# Altium project greenhouse_MA_2.PrjPcb
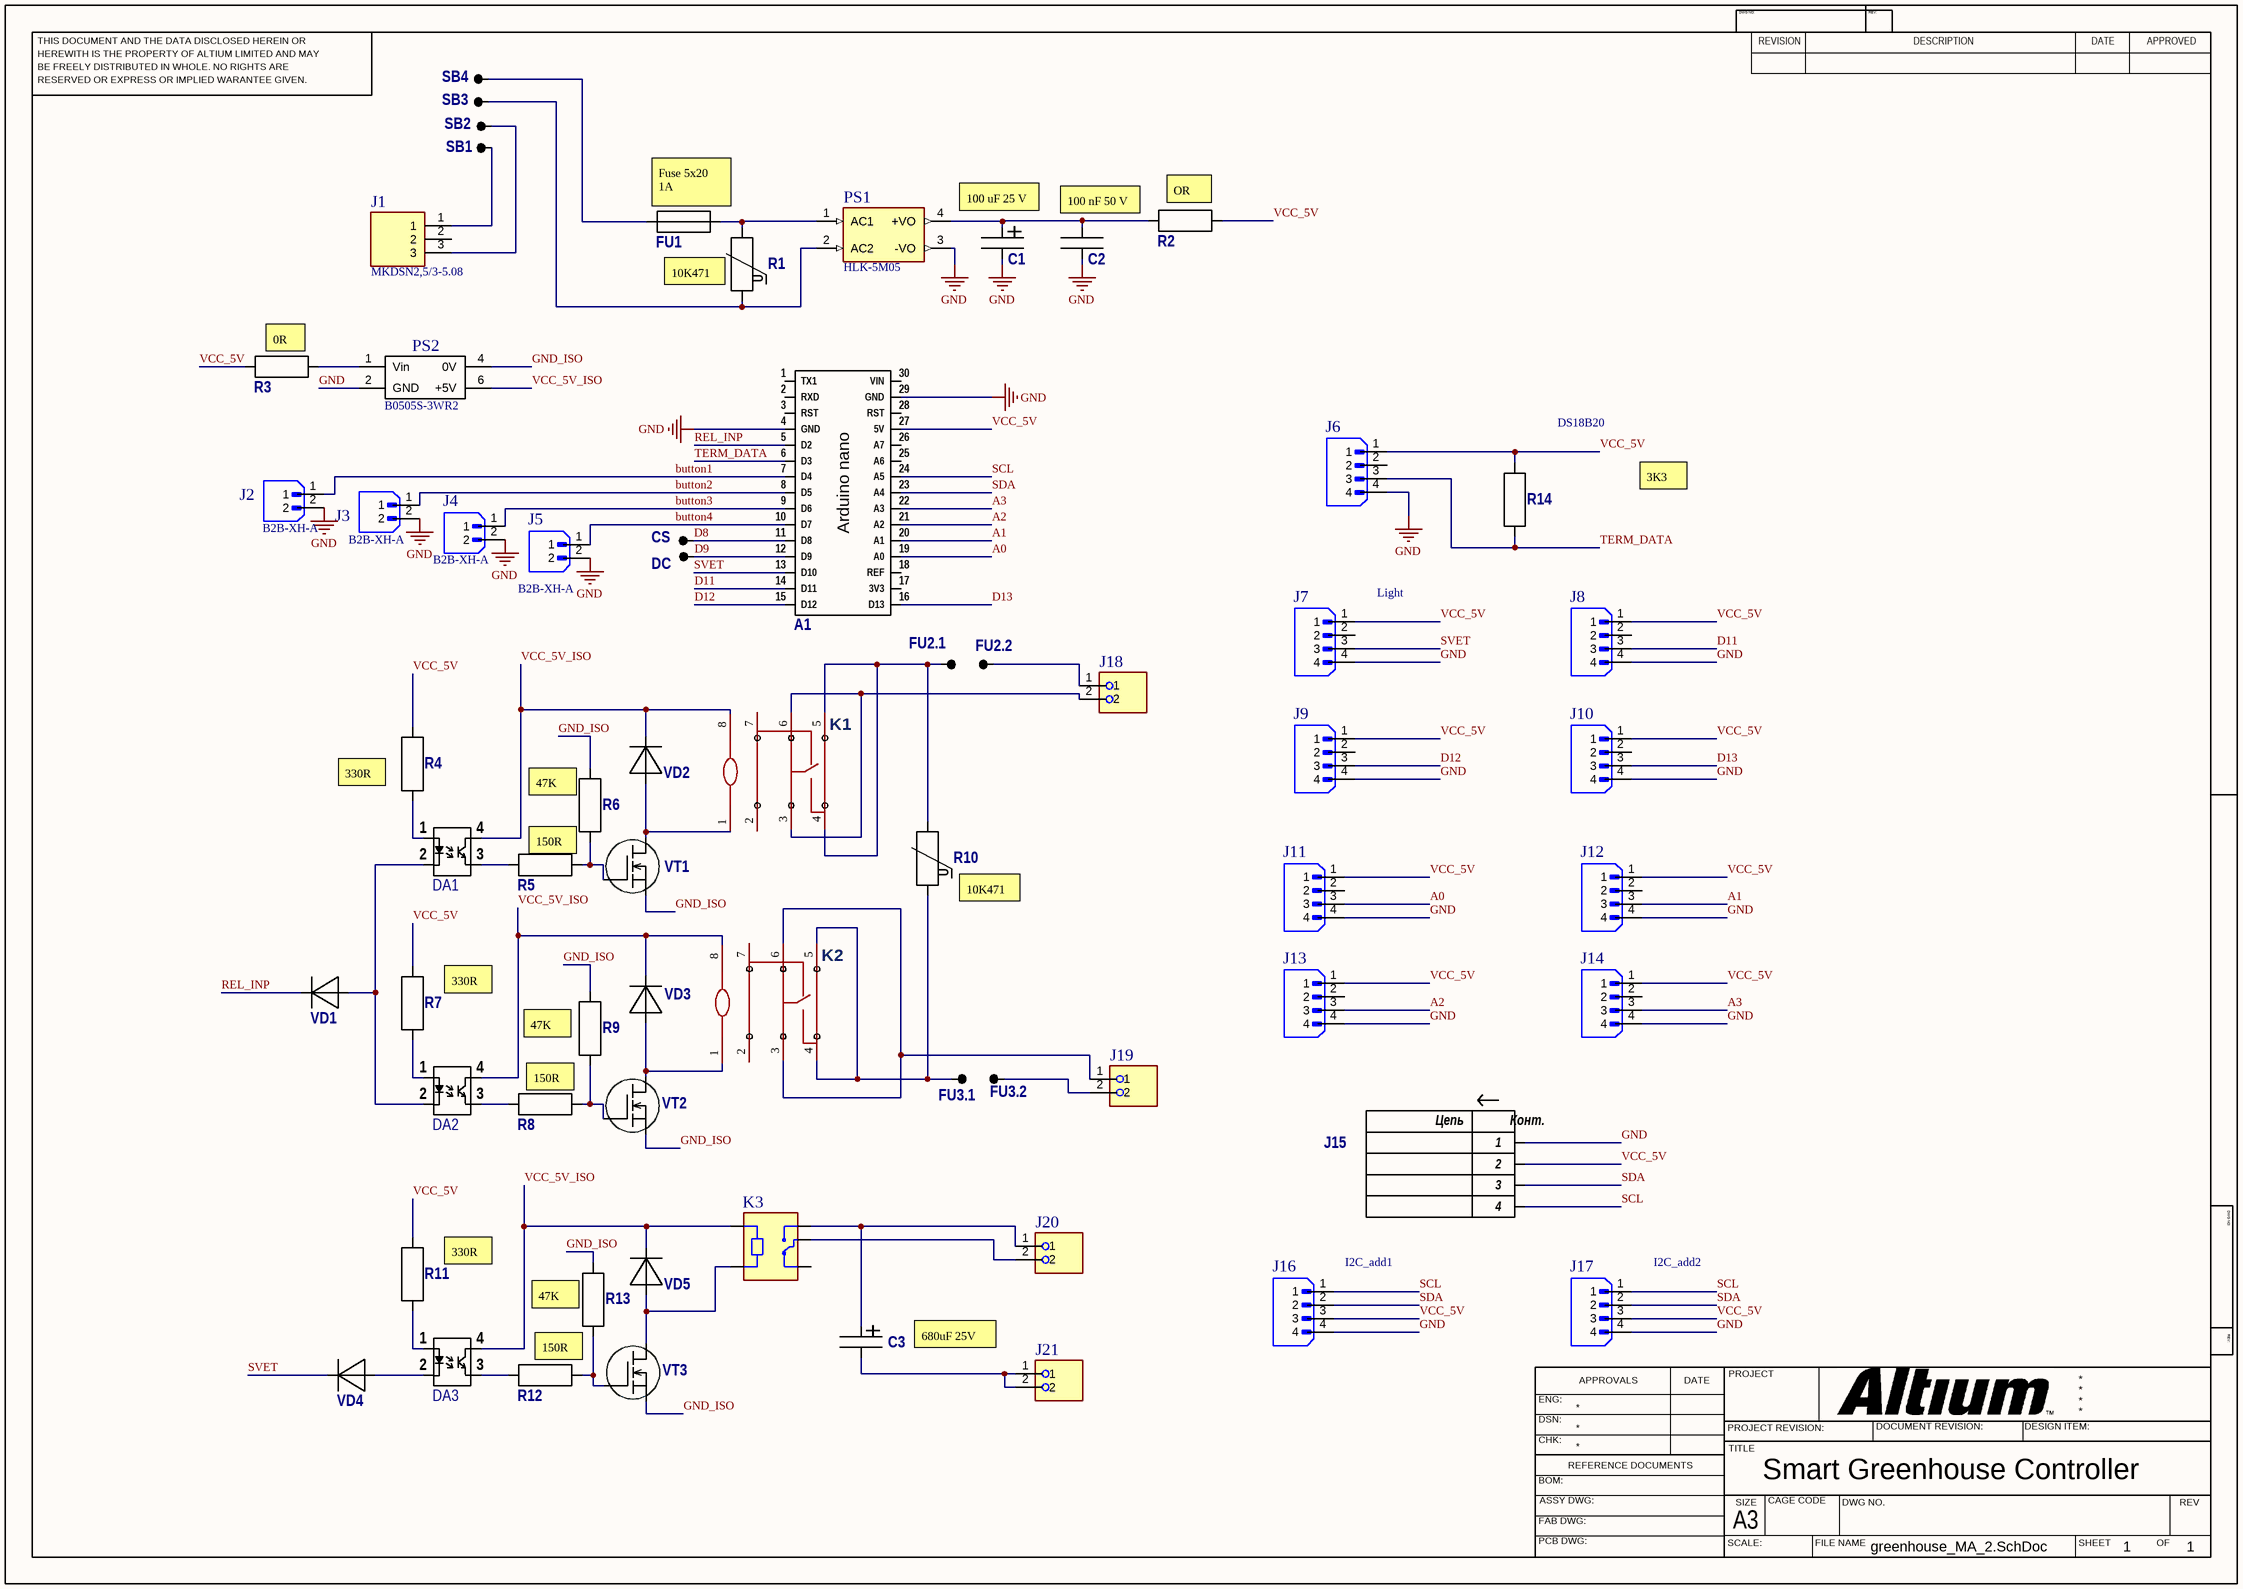
[diagram p0: greenhouse_MA_2.SchDoc]
1 sheet, 66 parts. Net scope: global (net labels, ports and power ports of the same name join across sheets).
Board file: greenhouse_MA_2PCB.PcbDoc

## Sheet greenhouse_MA_2.SchDoc: Smart Greenhouse Controller
size 420 x 297 mm; Author: Andrei Moskvin; Revision: v2; SheetNumber: 1; SheetTotal: 1

### Parts
A1  Arduino Nano  [Arduino nano]  (value not drawn)
C1  100uF 25V Electrolytic Capacitor THT Radial  [capr- 2.5D6.5H12]  (value not drawn)
C2  100nF 50V X7R THT 5mm  [C__s 5-d 5.5-t4]  (value not drawn)
C3  680uF 25V Electrolytic Capacitor THT Radial  [capr- 3.5D8H20]  (value not drawn)
CS  Отпайка  [Отпайка 0,5]  (value not drawn)
DA1  Optocoupler EL817 DIP-4  [DIP-4]  (value not drawn)
DA2  Optocoupler EL817 DIP-4  [DIP-4]  (value not drawn)
DA3  Optocoupler EL817 DIP-4  [DIP-4]  (value not drawn)
DC  Отпайка  [Отпайка 0,5]  (value not drawn)
FU1  1A slow 5x20 mm  [FU_FC-001-N(DH)]  (value not drawn)
FU2.1  Отпайка  [Отпайка 1.5]  (value not drawn)
FU2.2  Отпайка  [Отпайка 1.5]  (value not drawn)
FU3.1  Отпайка  [Отпайка 1.5]  (value not drawn)
FU3.2  Отпайка  [Отпайка 1.5]  (value not drawn)
J1  MKDSN2,5/3-5.08  [PHOENIX_MKDSN2,5/3-5.08]
J2  B2B-XH-A  [JST_B2B-XH-A]
J3  B2B-XH-A  [JST_B2B-XH-A]
J4  B2B-XH-A  [JST_B2B-XH-A]
J5  B2B-XH-A  [JST_B2B-XH-A]
J6  JST B4B-XH-A Connector 1x4 2.5mm THT Vertical  [JST_B4B-XH-A]  (value not drawn)
J7  JST B4B-XH-A Connector 1x4 2.5mm THT Vertical  [JST_B4B-XH-A]  (value not drawn)
J8  JST B4B-XH-A Connector 1x4 2.5mm THT Vertical  [JST_B4B-XH-A]  (value not drawn)
J9  JST B4B-XH-A Connector 1x4 2.5mm THT Vertical  [JST_B4B-XH-A]  (value not drawn)
J10  JST B4B-XH-A Connector 1x4 2.5mm THT Vertical  [JST_B4B-XH-A]  (value not drawn)
J11  JST B4B-XH-A Connector 1x4 2.5mm THT Vertical  [JST_B4B-XH-A]  (value not drawn)
J12  JST B4B-XH-A Connector 1x4 2.5mm THT Vertical  [JST_B4B-XH-A]  (value not drawn)
J13  JST B4B-XH-A Connector 1x4 2.5mm THT Vertical  [JST_B4B-XH-A]  (value not drawn)
J14  JST B4B-XH-A Connector 1x4 2.5mm THT Vertical  [JST_B4B-XH-A]  (value not drawn)
J15  Pin Header 1x4 2.54mm Right Angle THT Male  [KLS1-207-1*04 R]  (value not drawn)
J16  JST B4B-XH-A Connector 1x4 2.5mm THT Vertical  [JST_B4B-XH-A]  (value not drawn)
J17  JST B4B-XH-A Connector 1x4 2.5mm THT Vertical  [JST_B4B-XH-A]  (value not drawn)
J18  Phoenix Contact MKDSN 2,5/2-5.08 Terminal Block 1x2 5.08mm THT  [PHOENIX_1729128]  (value not drawn)
J19  Phoenix Contact MKDSN 2,5/2-5.08 Terminal Block 1x2 5.08mm THT  [PHOENIX_1729128]  (value not drawn)
J20  Phoenix Contact MKDSN 2,5/2-5.08 Terminal Block 1x2 5.08mm THT  [PHOENIX_1729128]  (value not drawn)
J21  Phoenix Contact MKDSN 2,5/2-5.08 Terminal Block 1x2 5.08mm THT  [PHOENIX_1729128]  (value not drawn)
K1  Relay SMIH-05VDC-SL-C 5V 16A THT  [SMIH-5VDC-SL-C]  (value not drawn)
K2  Relay SMIH-05VDC-SL-C 5V 16A THT  [SMIH-5VDC-SL-C]  (value not drawn)
K3  Relay SRD-05VDC-SL-C 5V 10A THT  [RELAY_SRD-05VDC-SL-C]  (value not drawn)
PS1  HLK-5M05  [CONV_HLK-5M05]
PS2  B0505S-3WR2  [B0505S-2W]
R1  10K471  [var 10D (Т-5мм)]  (value not drawn)
R2  0R 1% 1206  [Res_1206 3D]  (value not drawn)
R3  0R 1% 1206  [Res_1206 3D]  (value not drawn)
R4  330R 1% 1206  [Res_1206 3D]  (value not drawn)
R5  150R 1% 1206  [Res_1206 3D]  (value not drawn)
R6  47k 1% 1206  [Res_1206 3D]  (value not drawn)
R7  330R 1% 1206  [Res_1206 3D]  (value not drawn)
R8  150R 1% 1206  [Res_1206 3D]  (value not drawn)
R9  47k 1% 1206  [Res_1206 3D]  (value not drawn)
R10  10K471  [var 10D (Т-5мм)]  (value not drawn)
R11  330R 1% 1206  [Res_1206 3D]  (value not drawn)
R12  150R 1% 1206  [Res_1206 3D]  (value not drawn)
R13  47k 1% 1206  [Res_1206 3D]  (value not drawn)
R14  3.3K 1% 1206  [Res_1206 3D]  (value not drawn)
SB1  Отпайка  [Отпайка 1.2]  (value not drawn)
SB2  Отпайка  [Отпайка 1.2]  (value not drawn)
SB3  Отпайка  [Отпайка 1.2]  (value not drawn)
SB4  Отпайка  [Отпайка 1.2]  (value not drawn)
VD1  1N4007 1A 1000V Rectifier Diode DO-41  [DO-41  (5.0)]  (value not drawn)
VD2  UF4007 1A 1000V Fast Diode DO-41  [DO-41  (5.0)]  (value not drawn)
VD3  UF4007 1A 1000V Fast Diode DO-41  [DO-41  (5.0)]  (value not drawn)
VD4  1N4007 1A 1000V Rectifier Diode DO-41  [DO-41  (5.0)]  (value not drawn)
VD5  UF4007 1A 1000V Fast Diode DO-41  [DO-41  (5.0)]  (value not drawn)
VT1  IRLML6344  [SOT-23-3]  (value not drawn)
VT2  IRLML6344  [SOT-23-3]  (value not drawn)
VT3  IRLML6344  [SOT-23-3]  (value not drawn)

### Nets
GND: A1.4(GND) A1.29(GND) C1.1(-) C2.2 J2.2 J3.2 J4.2 J5.2 J6.4 J7.4 J8.4 J9.4 J10.4 J11.4 J12.4 J13.4 J14.4 J15.1 J16.4 J17.4 PS1.3(-VO) PS2.2(GND)
A0: A1.19(A0) J11.3
A1: A1.20(A1) J12.3
A2: A1.21(A2) J13.3
A3: A1.22(A3) J14.3
button1: A1.7(D4) J2.1
button2: A1.8(D5) J3.1
button3: A1.9(D6) J4.1
button4: A1.10(D7) J5.1
D8: A1.11(D8) CS.1
D9: A1.12(D9) DC.1
D11: A1.14(D11) J8.3
D12: A1.15(D12) J9.3
D13: A1.16(D13) J10.3
GND_ISO: PS2.4(0V) R6.2 R9.2 R13.2 VT1.3(S) VT2.3(S) VT3.3(S)
REL_INP: A1.5(D2) VD1.1(K)
SCL: A1.24(A5) J15.4 J16.1 J17.1
SDA: A1.23(A4) J15.3 J16.2 J17.2
SVET: A1.13(D10) J7.3 VD4.1(K)
TERM_DATA: A1.6(D3) J6.3 R14.1
VCC_5V: A1.27(5V) J6.1 J7.1 J8.1 J9.1 J10.1 J11.1 J12.1 J13.1 J14.1 J15.2 J16.3 J17.3 R2.1 R3.2 R4.2 R7.2 R11.2 R14.2
VCC_5V_ISO: DA1.4(C) DA2.4(C) DA3.4(C) K1.8 K2.8 K3.A1 PS2.6(+5V) VD2.1(K) VD3.1(K) VD5.1(K)
NetC1_2: C1.2(+) C2.1 PS1.4(+VO) R2.2
NetC3_1: C3.1(-) J21.1 J21.2
NetC3_2: C3.2(+) J20.1 K3.NO
NetDA1_1: DA1.1(Led_A) R4.1
NetDA1_2: DA1.2(Led_C) DA2.2(Led_C) VD1.2(A)
NetDA1_3: DA1.3(E) R5.1
NetDA2_1: DA2.1(Led_A) R7.1
NetDA2_3: DA2.3(E) R8.1
NetDA3_1: DA3.1(Led_A) R11.1
NetDA3_2: DA3.2(Led_C) VD4.2(A)
NetDA3_3: DA3.3(E) R12.1
NetFU1_1: FU1.1 SB4.1
NetFU1_2: FU1.2 PS1.1(AC1) R1.2
NetFU2.1_1: FU2.1.1 K1.4 K1.5 R10.2
NetFU2.2_1: FU2.2.1 J18.1
NetFU3.1_1: FU3.1.1 K2.4 K2.5 R10.1
NetFU3.2_1: FU3.2.1 J19.2
NetJ1_1: J1.1 SB1.1
NetJ1_3: J1.3 SB2.1
NetJ18_2: J18.2 K1.3 K1.6
NetJ19_1: J19.1 K2.3 K2.6
NetJ20_2: J20.2 K3.COM
NetK1_1: K1.1 VD2.2(A) VT1.2(D)
NetK2_1: K2.1 VD3.2(A) VT2.2(D)
NetK3_A2: K3.A2 VD5.2(A) VT3.2(D)
NetPS1_2: PS1.2(AC2) R1.1 SB3.1
NetPS2_1: PS2.1(Vin) R3.1
NetR5_2: R5.2 R6.1 VT1.1(G)
NetR8_2: R8.2 R9.1 VT2.1(G)
NetR12_2: R12.2 R13.1 VT3.1(G)

Not connected (* = marked no-connect by the designer): A1 1(TX1) 2(RXD) 3(RST) 17(3V3) 18(REF) 25(A6) 26(A7) 28(RST) 30(VIN); J1 2; J6 2; J7 2; J8 2; J9 2; J10 2; J11 2; J12 2; J13 2; J14 2; K1 2 7; K2 2 7; K3 NC

### Notes on the sheet
- (near FU1) Fuse 5x20 1A
- 100 uF 25 V
- 100 nF 50 V
- (near R2) OR
- (near R1) 10K471
- (near R3) 0R
- (near R14) DS18B20
- 3K3
- (near J7) Light
- (near R4) 330R
- (near R6) 47K
- 150R
- (near R10) 10K471
- (near R7) 330R
- (near R9) 47K
- (near R11) 330R
- (near J16) I2C_add1
- (near J17) I2C_add2
- (near R13) 47K
- 680uF 25V
- THIS DOCUMENT AND THE DATA DISCLOSED HEREIN OR
- HEREWITH IS THE PROPERTY OF ALTIUM LIMITED AND MAY
- DWG NO:
- REVISION
- REV:
- DESCRIPTION
- DATE
- APPROVED
- BE FREELY DISTRIBUTED IN WHOLE. NO RIGHTS ARE
- RESERVED OR EXPRESS OR IMPLIED WARANTEE GIVEN.
- ENG:
- APPROVALS
- PROJECT
- DSN:
- CHK:
- REFERENCE DOCUMENTS
- PROJECT REVISION:
- TITLE
- DOCUMENT REVISION:
- DESIGN ITEM:
- BOM:
- FAB DWG:
- PCB DWG:
- ASSY DWG:
- SCALE:
- A3
- SIZE
- CAGE CODE
- FILE NAME
- DWG NO.
- SHEET
- OF
- REV
- (in symbol Arduino Nano) Arduino nano
- (in symbol RU_1) U
- (in symbol Штырь 1* 4  (1)) Цепь; Конт.

### Library data of the parts
C1 C3 = C Al R: Конденсатор алюминиевый радиальный
C2 = C_Disk: Конденсатор керамика
CS DC FU2.1 FU2.2 FU3.1 FU3.2 SB1-SB4 = Отпайка: Отпайка для проводника
DA1-DA3 = EL817: Оптрон выход - транзистор
FU1 = FU + Clip: Предохранитель плавкий с держателем.
J1 = MKDSN2,5/3-5.08: HEADER, PCB, SCREW, 5.08MM, 3WAY; Connector Type: PCB; Series: MKDSN 2, 5; Connector Mounting: PCB; Pitch Spacing: 5....; MF: Phoenix Contact; MP: MKDSN2,5/3-5.08; Availability: Not in stock; SnapEDA_Link: https://www.snapeda.com/parts/MKDSN2,5/3-5.08/Phoenix+Contact/view-part/?ref=snap; Package: None; Check_prices: https://www.snapeda.com/parts/MKDSN2,5/3-5.08/Phoenix+Contact/view-part/?ref=eda; Value: *; Price: None
J2-J5 = B2B-XH-A: MF: {'manufacturer': u'JST Sales America Inc.'}; Package: None; Price: None; Value: *; MP: B2B-XH-A; Availability: Unavailable
J6-J14 J16 J17 = B4B-XH-A: Connector Header Through Hole 4 position 0.098 (2.50mm); MF: JST Sales; SnapEDA_Link: https://www.snapeda.com/parts/B4B-XH-A/JST/view-part/?ref=snap; Package: None; Value: *; MP: B4B-XH-A; Check_prices: https://www.snapeda.com/parts/B4B-XH-A/JST/view-part/?ref=eda
J15 = Штырь 1* 4  (1): Разъём штыревой на плату 2.54мм 1х4 pin
J18-J21 = 1729128: PCB Terminal Screw 5.08mm 16AWG 400V 13.5A 2 Position COMBICON MKDSN Series | Phoenix Contact 1729128; SnapEDA_Link: https://www.snapeda.com/parts/1729128/Phoenix+Contact/view-part/?ref=snap; Package: None; Value: *; MF: Phoenix Contact; MP: 1729128; Check_prices: https://www.snapeda.com/parts/1729128/Phoenix+Contact/view-part/?ref=eda
K1 K2 = SMIH-05VDC-SL-C: Manufacturer: 松乐; Add into BOM: yes; Symbol: SMIH-05VDC-SL-C; Device: SMIH-05VDC-SL-C; LCSC Part Name: SMIH-05VDC-SL-C; Supplier Part: C17701758; Manufacturer Part: SMIH-05VDC-SL-C; Supplier Footprint: 插件,29.5x13mm; JLCPCB Part Class: Extended Part; Datasheet: https://item.szlcsc.com/datasheet/SMIH-05VDC-SL-C/18835689.html; Supplier: LCSC; Convert to PCB: yes
K3 = SRD-05VDC-SL-C: 5V Trigger Relay Module For Arduino And Raspberry Pi 5V Trigger Relay Module For Arduino And Raspberry Pi; MF: Songle Relay; Check_prices: https://www.snapeda.com/parts/SRD-05VDC-SL-C/Songle+Relay/view-part/?ref=eda; Value: *; Availability: Not in stock; Price: None; Package: NON STANDARD-5 Songle Relay; MP: SRD-05VDC-SL-C; SnapEDA_Link: https://www.snapeda.com/parts/SRD-05VDC-SL-C/Songle+Relay/view-part/?ref=snap
PS1 = HLK-5M05: AC DC 220V to 5V 5W 5Watt Isolated Switching Step-Down Power Supply Module Converter; MF: Hi-link; Check_prices: https://www.snapeda.com/parts/HLK-5M05/Hi-link/view-part/?ref=eda; SnapEDA_Link: https://www.snapeda.com/parts/HLK-5M05/Hi-link/view-part/?ref=snap; Price: None; Availability: Not in stock; Package: Package; MP: HLK-5M05; Value: *
PS2 = B0505S-2W: Изолированный DC-DC преобразователь, вход 5В, выход 5В 3Вт
R1 R10 = RU_1: Варистор
R2-R9 R11-R14 = R: Резисторы плёночные (SMD; МЛТ; С2-33Н; MP9xxx)
VD1-VD5 = Диод.  x1  (2): Диод  одиночный
VT1-VT3 = VT MOSFET-N: Транзистор MOSFET N-канал